# Altium schematic sheet final_schematic.SchDoc
size A
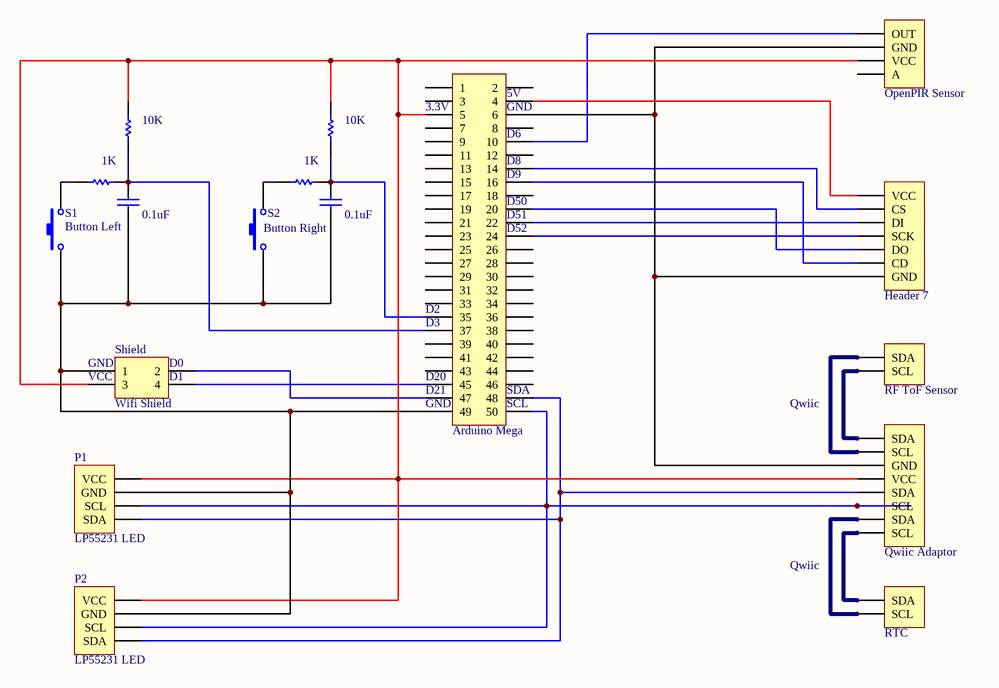
[diagram p0: final_schematic.SchDoc]

## Parts
(Parts that share a designator on the sheet are numbered #1, #2 ... from top to bottom, then left to right.)
1  RF ToF Sensor  [HDR1X2]
131  value 0.1uF  [RAD-0.3]  (hidden comment: Cap)
321  value 1K  [AXIAL-0.3]  (hidden comment: Res1)
?  RTC  [HDR1X2]
C?  value 0.1uF  [RAD-0.3]  (hidden comment: Cap)
g  OpenPIR Sensor  [HDR1X4]
P1  LP55231 LED  [HDR1X4]
P2  LP55231 LED  [HDR1X4]
P?#1  Arduino Mega  [HDR2X25]
P?#2  Header 7  [HDR1X7]
P?#3  Qwiic Adaptor  [HDR1X8]
R1  value 10K  [AXIAL-0.3]  (hidden comment: Res1)
r2  value 10K  [AXIAL-0.3]  (hidden comment: Res1)
R?  value 1K  [AXIAL-0.3]  (hidden comment: Res1)
S1  Button Left  [SPST-2]
S2  Button Right  [SPST-2]
Shield  Wifi Shield  [HDR2X2H]

## Nets
Net1_1: 1.1(SDA) P?#3.2(SCL)
Net1_2: 1.2(SCL) P?#3.1(SDA)
Net131_1: 131.1 C?.1 P1.3(GND) P2.3(GND) P?#1.49 S1.1 S2.1 Shield.1
Net131_2: 131.2 321.2 P?#1.35 r2.2
Net321_1: 321.1 S2.2
Net?_1: ?.1(SDA) P?#3.8(SCL)
Net?_2: ?.2(SCL) P?#3.7(SDA)
NetC?_2: C?.2 P?#1.37 R1.2 R?.2
Netg_1: g.1(OUT) P?#1.10
Netg_2: g.2(GND) P?#1.6 P?#2.7(GND) P?#3.3(GND)
Netg_3: g.3(VCC) P1.4(VCC) P2.4(VCC) P?#1.5 P?#3.4(VCC) R1.1 r2.1 Shield.3
NetP1_1: P1.1(SDA) P2.1(SDA) P?#1.48 P?#3.5(SDA)
NetP1_2: P1.2(SCL) P2.2(SCL) P?#1.50 P?#3.6(SCL)
NetP?#1_4: P?#1.4 P?#2.1(VCC)
NetP?#1_14: P?#1.14 P?#2.2(CS)
NetP?#1_16: P?#1.16 P?#2.6(CD)
NetP?#1_20: P?#1.20 P?#2.5(DO)
NetP?#1_22: P?#1.22 P?#2.3(DI)
NetP?#1_24: P?#1.24 P?#2.4(SCK)
NetP?#1_45: P?#1.45 Shield.4
NetP?#1_47: P?#1.47 Shield.2
NetR?_1: R?.1 S1.2

Not connected (* = marked no-connect by the designer): g 4(A); P?#1 1 2 3 7 8 9 11 12 13 15 17 18 19 21 23 25 26 27 28 29 30 31 32 33 34 36 38 39 40 41 42 43 44 46

## Notes on the sheet
- (near P?#1) 3.3V
- (near P?#1) 5V
- (near P?#1) GND
- (near P?#1) D8
- (near P?#1) D9
- (near P?#1) D6
- (near P?#1) D50
- (near P?#1) D51
- (near P?#1) D52
- (near P?#1) D2
- (near P?#1) D3
- (near Shield) GND
- (near Shield) VCC
- (near Shield) D0
- (near Shield) D1
- (near P?#1) D21
- (near P?#1) D20
- (near P?#1) SDA
- (near P?#1) SCL
- Qwiic

## Library data of the parts
1 ? = Header 2: Header, 2-Pin; LatestRevisionDate: 17-Jul-2002; LatestRevisionNote: Re-released for DXP Platform.; Publisher: Altium Limited
131 C? = Cap: Capacitor; Published: 8-Jun-2000; LatestRevisionDate: 17-Jul-2002; LatestRevisionNote: Re-released for DXP Platform.; PackageReference: RAD-0.3; Publisher: Altium Limited; PackageDescription: Radial Cap, Thru-Hole; 2 Leads; 0.3 in Pin Spacing
321 R1 r2 R? = Res1: Resistor; Published: 8-Jun-2000; LatestRevisionDate: 17-Jul-2002; LatestRevisionNote: Re-released for DXP Platform.; PackageReference: AXIAL-0.3; Publisher: Altium Limited; PackageDescription: Axial Device, Thru-Hole; 2 Leads; 0.3 in Pin Spacing
g P1 P2 = Header 4: Header, 4-Pin; LatestRevisionDate: 17-Jul-2002; LatestRevisionNote: Re-released for DXP Platform.; Publisher: Altium Limited
P?#1 = Header 25X2: Header, 25-Pin, Dual row; LatestRevisionDate: 17-Jul-2002; LatestRevisionNote: Re-released for DXP Platform.; Publisher: Altium Limited
P?#2 = Header 7: Header, 7-Pin; LatestRevisionDate: 17-Jul-2002; LatestRevisionNote: Re-released for DXP Platform.; Publisher: Altium Limited
P?#3 = Header 8: Header, 8-Pin; LatestRevisionDate: 17-Jul-2002; LatestRevisionNote: Re-released for DXP Platform.; Publisher: Altium Limited
S1 S2 = SW-PB: Switch; Published: 24-Mar-1999; LatestRevisionDate: 17-Jul-2002; LatestRevisionNote: Re-released for DXP Platform.; PackageReference: SPST-2; Publisher: Altium Limited; PackageDescription: Switch; 2 Leads
Shield = Header 2X2H: Header, 2-Pin, Dual row, Right Angle; LatestRevisionDate: 17-Jul-2002; LatestRevisionNote: Re-released for DXP Platform.; Publisher: Altium Limited